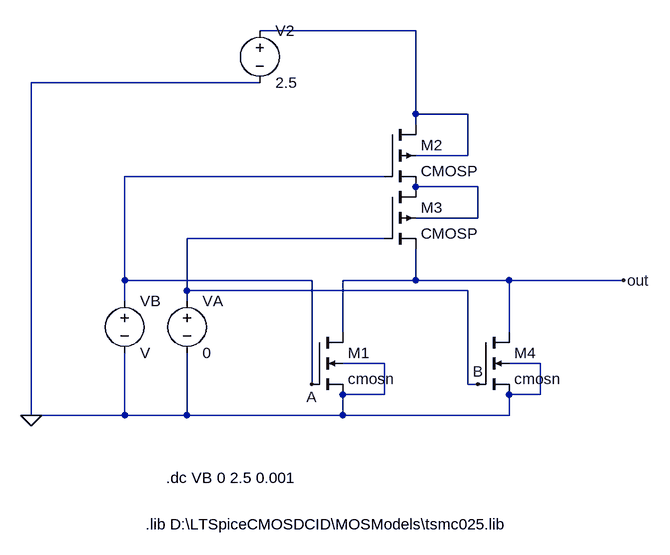
[diagram p0: schematic 250n_nor_gate.asc]
250n_nor_gate.asc, the LTspice schematic file:
Version 4
SHEET 1 1736 680
WIRE 1360 -512 1120 -512
WIRE 1120 -432 768 -432
WIRE 1360 -384 1360 -512
WIRE 1440 -384 1360 -384
WIRE 1360 -368 1360 -384
WIRE 1440 -320 1440 -384
WIRE 1440 -320 1360 -320
WIRE 1312 -288 912 -288
WIRE 1456 -272 1360 -272
WIRE 1456 -224 1456 -272
WIRE 1456 -224 1360 -224
WIRE 1312 -192 1008 -192
WIRE 912 -128 912 -288
WIRE 1200 -128 912 -128
WIRE 1360 -128 1360 -176
WIRE 1360 -128 1248 -128
WIRE 1504 -128 1360 -128
WIRE 1680 -128 1504 -128
WIRE 1008 -112 1008 -192
WIRE 1440 -112 1008 -112
WIRE 912 -96 912 -128
WIRE 1008 -96 1008 -112
WIRE 1248 -48 1248 -128
WIRE 1504 -48 1504 -128
WIRE 1312 0 1248 0
WIRE 1552 0 1504 0
WIRE 1200 32 1200 -128
WIRE 1440 32 1440 -112
WIRE 1456 32 1440 32
WIRE 1312 48 1312 0
WIRE 1312 48 1248 48
WIRE 1552 48 1552 0
WIRE 1552 48 1504 48
WIRE 768 80 768 -432
WIRE 912 80 912 -16
WIRE 912 80 768 80
WIRE 1008 80 1008 -16
WIRE 1008 80 912 80
WIRE 1248 80 1248 48
WIRE 1248 80 1008 80
WIRE 1504 80 1504 48
WIRE 1504 80 1248 80
FLAG 1200 32 A
FLAG 1456 32 B
FLAG 1680 -128 out
FLAG 768 80 0
SYMBOL nmos4 1200 -48 R0
SYMATTR InstName M1
SYMATTR Value cmosn
SYMATTR Value2 l=250n w=360n ad=0.1728p as=0.1728p pd=1680n ps=1680n
SYMBOL voltage 912 -112 R0
SYMATTR InstName VB
SYMBOL voltage 1120 -528 R0
WINDOW 123 0 0 Left 0
WINDOW 39 0 0 Left 0
SYMATTR InstName V2
SYMATTR Value 2.5
SYMBOL cmosp 1312 -368 R0
SYMATTR InstName M2
SYMATTR Value2 l=250n w=1440n ad=0.1728p as=0.1728p pd=1680n ps=1680n
SYMBOL cmosp 1312 -272 R0
SYMATTR InstName M3
SYMATTR Value2 l=250n w=1440n ad=0.1728p as=0.1728p pd=1680n ps=1680n
SYMBOL nmos4 1456 -48 R0
SYMATTR InstName M4
SYMATTR Value cmosn
SYMATTR Value2 l=250n w=360n ad=0.1728p as=0.1728p pd=1680n ps=1680n
SYMBOL voltage 1008 -112 R0
WINDOW 123 0 0 Left 0
WINDOW 39 0 0 Left 0
SYMATTR InstName VA
SYMATTR Value 0
TEXT 976 176 Left 2 !.dc VB 0 2.5 0.001
TEXT 944 248 Left 2 !.lib D:\\LTSpiceCMOSDCID\\MOSModels\\tsmc025.lib

The netlist it stands for:
* 250n_nor_gate.asc
M1 out A 0 0 cmosn l=250n w=360n ad=0.1728p as=0.1728p pd=1680n ps=1680n
VB A 0 V
V2 N001 0 2.5
M2 N001 A N002 N001 CMOSP l=250n w=1440n ad=0.1728p as=0.1728p pd=1680n ps=1680n
M3 N002 B out N002 CMOSP l=250n w=1440n ad=0.1728p as=0.1728p pd=1680n ps=1680n
M4 out B 0 0 cmosn l=250n w=360n ad=0.1728p as=0.1728p pd=1680n ps=1680n
VA B 0 0
.model NMOS NMOS
.model PMOS PMOS
.lib standard.mos
.dc VB 0 2.5 0.001
.lib D:\LTSpiceCMOSDCID\MOSModels\tsmc025.lib
.backanno
.end